# Altium schematic sheet [18] Power_Management.SchDoc: Power Management
size B; DocumentNumber: I; Revision: 01; SheetNumber: 18; SheetTotal: 19
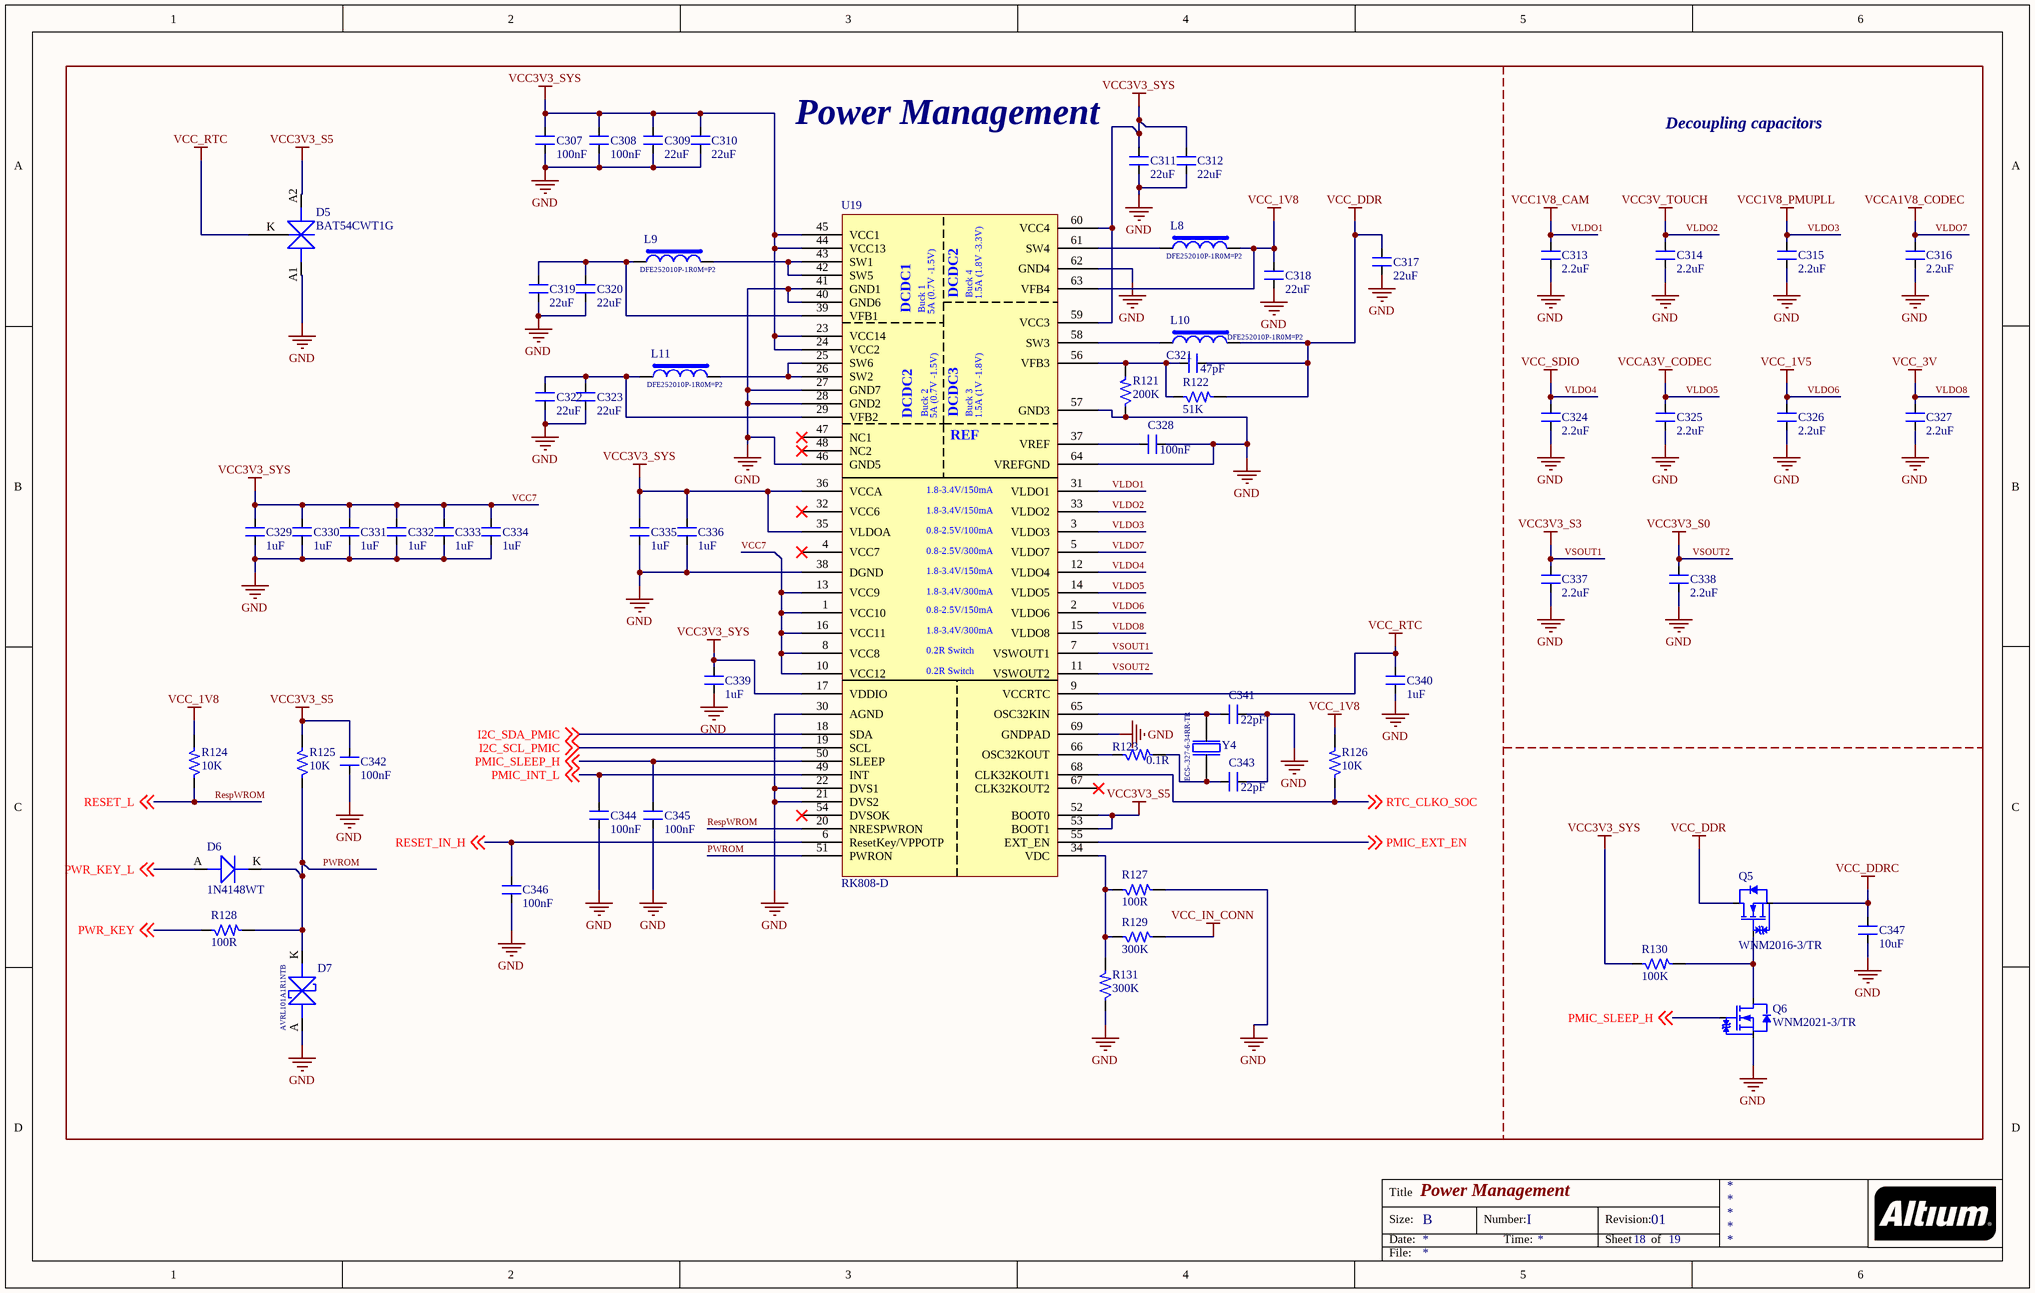
[diagram p0: [18] Power_Management.SchDoc]

## Parts
C307  100nF  [CAP_0402]
C308  100nF  [CAP_0402]
C309  22uF  [CAP_0603]
C310  22uF  [CAP_0603]
C311  22uF  [CAP_0603]
C312  22uF  [CAP_0603]
C313  2.2uF  [CAP_0402]
C314  2.2uF  [CAP_0402]
C315  2.2uF  [CAP_0402]
C316  2.2uF  [CAP_0402]
C317  22uF  [CAP_0603]
C318  22uF  [CAP_0603]
C319  22uF  [CAP_0603]
C320  22uF  [CAP_0603]
C321  47pF  [CAP_0402]
C322  22uF  [CAP_0603]
C323  22uF  [CAP_0603]
C324  2.2uF  [CAP_0402]
C325  2.2uF  [CAP_0402]
C326  2.2uF  [CAP_0402]
C327  2.2uF  [CAP_0402]
C328  100nF  [CAP_0402]
C329  1uF  [CAP_0402]
C330  1uF  [CAP_0402]
C331  1uF  [CAP_0402]
C332  1uF  [CAP_0402]
C333  1uF  [CAP_0402]
C334  1uF  [CAP_0402]
C335  1uF  [CAP_0402]
C336  1uF  [CAP_0402]
C337  2.2uF  [CAP_0402]
C338  2.2uF  [CAP_0402]
C339  1uF  [CAP_0402]
C340  1uF  [CAP_0402]
C341  22pF  [CAP_0402]
C342  100nF  [CAP_0402]
C343  22pF  [CAP_0402]
C344  100nF  [CAP_0402]
C345  100nF  [CAP_0402]
C346  100nF  [CAP_0402]
C347  10uF  [CAP_0402]
D5  BAT54CWT1G  [DIO_SOT-323-3]
D6  1N4148WT  [DIO_SOD523]
D7  AVRL101A1R1NTB  [DIO_0402_SMD]
L8  DFE252010P-1R0M=P2  [IND_1008]
L9  DFE252010P-1R0M=P2  [IND_1008]
L10  DFE252010P-1R0M=P2  [IND_1008]
L11  DFE252010P-1R0M=P2  [IND_1008]
Q5  WNM2016-3/TR  [SOT 23-3]
Q6  WNM2021-3/TR  [SOT-323-3]
R121  200K  [RES_0402]
R122  51K  [RES_0402]
R123  0.1R  [RES_0402]
R124  10K  [RES_0402]
R125  10K  [RES_0402]
R126  10K  [RES_0402]
R127  100R  [RES_0402]
R128  100R  [RES_0402]
R129  300K  [RES_0402]
R130  100K  [RES_0402]
R131  300K  [RES_0402]
U19  RK808-D  [QFN68_13.7_220.4X220.4_SMD]
Y4  ECS-.327-6-34RR-TR  [XTAL_ECS-.327-6-34RR-TR]

## Nets
GND: C307.1 C308.1 C309.1 C310.1 C311.1 C312.1 C313.1 C314.1 C315.1 C316.1 C317.1 C318.1 C319.1 C320.1 C322.1 C323.1 C324.1 C325.1 C326.1 C327.1 C328.2 C329.1 C330.1 C331.1 C332.1 C333.1 C334.1 C335.1 C336.1 C337.1 C338.1 C339.1 C340.1 C341.2 C342.1 C343.2 C344.1 C345.1 C346.1 C347.1 D5.A1 D7.A Q6.2(S) R121.1 R127.2 R131.1 U19.21(DVS2) U19.22(DVS1) U19.27(GND7) U19.28(GND2) U19.30(AGND) U19.38(DGND) U19.40(GND6) U19.41(GND1) U19.46(GND5) U19.57(GND3) U19.62(GND4) U19.64(VREFGND) U19.69(GNDPAD)
VCC3V3_S5: C342.2 D5.A2 R125.2 U19.52(BOOT0) U19.53(BOOT1)
VCC7: C307.2 C308.2 C309.2 C310.2 C311.2 C312.2 C329.2 C330.2 C331.2 C332.2 C333.2 C334.2 C335.2 C336.2 C339.2 R130.1 U19.1(VCC10) U19.8(VCC8) U19.10(VCC12) U19.13(VCC9) U19.16(VCC11) U19.17(VDDIO) U19.23(VCC14) U19.24(VCC2) U19.35(VLDOA) U19.36(VCCA) U19.44(VCC13) U19.45(VCC1) U19.59(VCC3) U19.60(VCC4)  [also labelled VCC3V3_SYS]
VCC_1V8: C318.2 L8.2 R124.2 R126.2 U19.63(VFB4)
VCC_DDR: C317.2 C321.2 L10.2 Q5.3(D) R122.2
VCC_DDRC: C347.2 Q5.2(S)
VCC_IN_CONN: R129.2
VCC_RTC: C340.2 D5.K U19.9(VCCRTC)
VLDO1: C313.2 U19.31(VLDO1)  [also labelled VCC1V8_CAM]
VLDO2: C314.2 U19.33(VLDO2)  [also labelled VCC3V_TOUCH]
VLDO3: C315.2 U19.3(VLDO3)  [also labelled VCC1V8_PMUPLL]
VLDO4: C324.2 U19.12(VLDO4)  [also labelled VCC_SDIO]
VLDO5: C325.2 U19.14(VLDO5)  [also labelled VCCA3V_CODEC]
VLDO6: C326.2 U19.2(VLDO6)  [also labelled VCC_1V5]
VLDO7: C316.2 U19.5(VLDO7)  [also labelled VCCA1V8_CODEC]
VLDO8: C327.2 U19.15(VLDO8)  [also labelled VCC_3V]
VSOUT1: C337.2 U19.7(VSWOUT1)  [also labelled VCC3V3_S3]
VSOUT2: C338.2 U19.11(VSWOUT2)  [also labelled VCC3V3_S0]
I2C_SCL_PMIC: U19.19(SCL) ; off-sheet I2C_SCL_PMIC
I2C_SDA_PMIC: U19.18(SDA) ; off-sheet I2C_SDA_PMIC
PMIC_EXT_EN: U19.55(EXT_EN) ; off-sheet PMIC_EXT_EN
PMIC_INT_L: C344.2 U19.49(INT) ; off-sheet PMIC_INT_L
PMIC_SLEEP_H: C345.2 Q6.1(G) U19.50(SLEEP) ; off-sheet PMIC_SLEEP_H
PWR_KEY: R128.1 ; off-sheet PWR_KEY
PWR_KEY_L: D6.A(ANODE) ; off-sheet PWR_KEY_L
PWROM: D6.K(CATHODE) D7.K R125.1 R128.2 U19.51(PWRON)
RESET_IN_H: C346.2 U19.6(ResetKey/VPPOTP) ; off-sheet RESET_IN_H
RespWROM: R124.1 U19.20(NRESPWRON) ; off-sheet RESET_L  [also labelled RESET_L]
RTC_CLKO_SOC: R126.1 U19.68(CLK32KOUT1) ; off-sheet RTC_CLKO_SOC
NetC319_2: C319.2 C320.2 L9.1 U19.39(VFB1)
NetC321_1: C321.1 R121.2 R122.1 U19.56(VFB3)
NetC322_2: C322.2 C323.2 L11.1 U19.29(VFB2)
NetC328_1: C328.1 U19.37(VREF)
NetC341_1: C341.1 U19.65(OSC32KIN) Y4.2
NetC343_1: C343.1 R123.2 Y4.1
NetL8_1: L8.1 U19.61(SW4)
NetL9_2: L9.2 U19.42(SW5) U19.43(SW1)
NetL10_1: L10.1 U19.58(SW3)
NetL11_2: L11.2 U19.25(SW6) U19.26(SW2)
NetQ5_1: Q5.1(G) Q6.3(D) R130.2
NetR123_1: R123.1 U19.66(OSC32KOUT)
NetR127_1: R127.1 R129.1 R131.2 U19.34(VDC)

Not connected (* = marked no-connect by the designer): U19 4(VCC7)* 32(VCC6)* 47(NC1)* 48(NC2)* 54(DVSOK)* 67(CLK32KOUT2)*

## Notes on the sheet
- Power Management
- Decoupling capacitors
- Title
- Size:
- Date:
- B
- Number:
- Time:
- Revision:
- Sheet
- of
- File:
- (in symbol IC_RK808-D-QFN68) DCDC2; Buck 4; 1.5A (1.8V -3.3V); DCDC1; Buck 1; 5A (0.7V -1.5V); Buck 2; DCDC3; Buck 3; 1.5A (1V -1.8V); REF; 1.8-3.4V/150mA; 0.8-2.5V/100mA; 0.8-2.5V/300mA; 1.8-3.4V/300mA; 0.8-2.5V/150mA; 0.2R Switch

## Library data of the parts
C307 C308 = CAP_100nF-25V-10%-0402: 0.1µF ±10% 25V Ceramic Capacitor X7R 0402 (1005 Metric) /; Manufacturer: Walsin Technology Corporation; Manufacturer Part Number: 0402B104K250CT; Case/Package: 0402; Supplier-1: Digikey
C309-C312 C317-C320 C322 C323 = CAP_22uF-10V-20%-0603: 22µF ±20% 10V Ceramic Capacitor X5R 0603 (1608 Metric) /; Manufacturer: Murata Electronics; Manufacturer Part Number: GRM188R61A226ME15D; Case/Package: 0603; Supplier-1: Digikey
C313-C316 C324-C327 C337 C338 = CAP_2.2uF-10V-10%-0402: 2.2µF ±10% 10V Ceramic Capacitor X5R 0402 (1005 Metric) /; Manufacturer: Murata Electronics; Manufacturer Part Number: GRM155R61A225KE95D; Case/Package: 0402; Supplier-1: Digikey
C321 = CAP_47pF-10V-10%-0402: 47pF ±10% 10V Ceramic Capacitor C0G, NP0 0402 (1005 Metric) /; Manufacturer: KEMET; Manufacturer Part Number: C0402C470K8GAC7867; Case/Package: 0402; Supplier-1: Supplier-1
C328 C342 C344-C346 = CAP_100nF-10V-10%-0402: 0.1µF ±10% 10V Ceramic Capacitor X7R 0402 (1005 Metric) /; Manufacturer: Yageo; Manufacturer Part Number: CC0402KRX7R6BB104; Case/Package: 0402; Supplier-1: Digikey
C329-C336 C339 = CAP_1uF-10V-10%-0402: 1µF ±10% 10V Ceramic Capacitor X6S 0402 (1005 Metric) /; Manufacturer: Murata Electronics; Manufacturer Part Number: GRT155C81A105KE01D; Case/Package: 0402; Supplier-1: Digikey
C340 = CAP_1uF-16V-10%-0402: 1µF ±10% 16V Ceramic Capacitor X5R 0402 (1005 Metric) /; Manufacturer: Knowles Novacap; Manufacturer Part Number: 0402BW105K160YT; Case/Package: 0402; Supplier-1: Digikey
C341 C343 = CAP_22pF-10V-10%-0402: 22pF ±10% 10V Ceramic Capacitor C0G, NP0 0402 (1005 Metric) /; Manufacturer: KEMET; Manufacturer Part Number: C0402C220K8GACTU; Case/Package: 0402; Supplier-1: Digikey
C347 = CAP_10uF-10V-20%-0402: 10µF ±20% 10V Ceramic Capacitor X5R 0402 (1005 Metric) /; Manufacturer Part Number: CL05A106MP5NUNC; Manufacturer: Samsung Electro-Mechanics; Case/Package: 0402; Supplier-1: Digikey
D5 = DIO-S-A_30V-200mA-SOT-323: Diode Array 1 Pair Common Cathode Schottky 30V 200mA (DC) Surface Mount SC-70, SOT-323; Manufacturer: ON Semiconductor; Manufacturer Part Number: BAT54CWT1G; Case/Package: SOT323; Supplier-1: Digikey
D6 = DIO_75V-200mA-SOD-523F: Diode Standard 100V 300mA (DC) Surface Mount SOD-123; Manufacturer: FAIRCHILD; Manufacturer Part Number: 1N4148WT; Case/Package: SOD123; Supplier-1: SIRICOM
D7 = DIO-T_10V-39V-0402: 39V Varistor 1 Circuit Surface Mount, MLCV 0402 (1005 Metric); Manufacturer: TDK Corporation; Manufacturer Part Number: AVRL101A1R1NTB; Supplier-1: Digikey; Case/Package: 0402
L8-L11 = IND_1uH-3.8A-20%-1008: 1µH Shielded Wirewound Inductor 3.8A 54mOhm Max 1008 (2520 Metric) /; Manufacturer: Murata Electronics; Manufacturer Part Number: DFE252010P-1R0M=P2; Case/Package: 1008; Supplier-1: Digikey
Q5 = MOSFET-N_20V-2.9A-SOT-23: N Channel 20V 2.9A 1V @ 250uA 47mΩ @ 3.6A,4.5V 700mW SOT-23(SOT-23-3) MOSFET RoHS /; Manufacturer: WILLSEMI(Will Semicon); Manufacturer Part Number: WNM2016-3/TR; Case/Package: SOT-23(SOT-23-3); Supplier-1: LCSC
Q6 = MOSFET-N_20V-820mA-SOT-323: N Channel 20V 820mA 850mV @ 250uA 310mΩ @ 550mA,4.5V 310mW SOT-323(SC-70) MOSFET RoHS /; Manufacturer: WILLSEMI(Will Semicon); Manufacturer Part Number: WNM2021-3/TR; Case/Package: SOT-323(SC-70); Supplier-1: LCSC
R121 = RES_200K-0.1W-1%-0402: 200 kOhms ±1% 0.1W, 1/10W Chip Resistor 0402 (1005 Metric) Automotive AEC-Q200 Thick Film /; Manufacturer: Panasonic Electronic Components; Manufacturer Part number: ERJ-2RKF2003X; Case/Package: 0402; Supplier-1: Digikey
R122 = RES_51K-0.1W-1%-0402: 51 kOhms ±1% 0.1W, 1/10W Chip Resistor 0402 (1005 Metric) Automotive AEC-Q200 Thick Film /; Manufacturer: Panasonic Electronic Components; Manufacturer Part Number: ERJ-2RKF5102X; Case/Package: 0402; Supplier-1: Digikey
R123 = RES_0.1R-0.1W-1%-0402: 100 mOhms ±1% 0.1W, 1/10W Chip Resistor 0402 (1005 Metric) Current Sense, Moisture Resistant Thick Film /; Manufacturer: Samsung Electro-Mechanics; Manufacturer Part Number: RUT1005FR100CS; Casse/Package: 0402; Supplier-1: Digikey
R124-R126 = RES_10K-0.1W-1%-0402: 10 kOhms ±1% 0.1W, 1/10W Chip Resistor 0402 (1005 Metric) Anti-Sulfur Thin Film /; Manufacturer: Vishay Beyschlag/Draloric/BC Components; Manufacturer Part Number: MCS04020C1002FE000; Case/Package: 0402; Supplier-1: Digikey
R127 R128 = RES_100R-0.1W-1%-0402: 100 Ohms ±1% 0.1W, 1/10W Chip Resistor 0402 (1005 Metric) Automotive AEC-Q200, Moisture Resistant Thick Film /; Manufacturer: KOA Speer Electronics, Inc.; Manufacturer Part Number: RK73H1ETTP1000F; Case/Package: 0402; Supplier-1: Digikey
R129 R131 = RES_300K-0.1W-1%-0402: 300 kOhms ±1% 0.1W, 1/10W Chip Resistor 0402 (1005 Metric) Automotive AEC-Q200 Thick Film /; Manufacturer: Panasonic Electronic Components; Manufacturer Part Number: ERJ-2RKF3003X; Case/Package: 0402; Supplier-1: Digikey
R130 = RES_100K-0.1W-1%-0402: 100 kOhms ±1% 0.1W, 1/10W Chip Resistor 0402 (1005 Metric) Anti-Sulfur Thin Film /; Manufacturer: Vishay Beyschlag/Draloric/BC Components; Manufacturer Part Number: MCS04020C1003FE000; Case/Package: 0402; Supplier-1: Digikey
U19 = IC_RK808-D-QFN68: The RK808 is a complete power supply solution for Portable systems.; Manufacturer: Rockchip; Manufacturer Part Number: RK808-D; Case/Package: QFN68; Supplier-1: Rockchip
Y4 = XTAL_32.768Khz-22pF-SMD: 32.768kHz ±20ppm Crystal 12pF 80 kOhms 2-SMD, No Lead /; Manufacturer: Ecliptek; Manufacturer Part Number: ECS-.327-6-34RR-TR; Case/Package: 0603; Supplier-1: Digikey